# Altium schematic sheet BMS.SchDoc
size A1; SheetNumber: 5; SheetTotal: 6
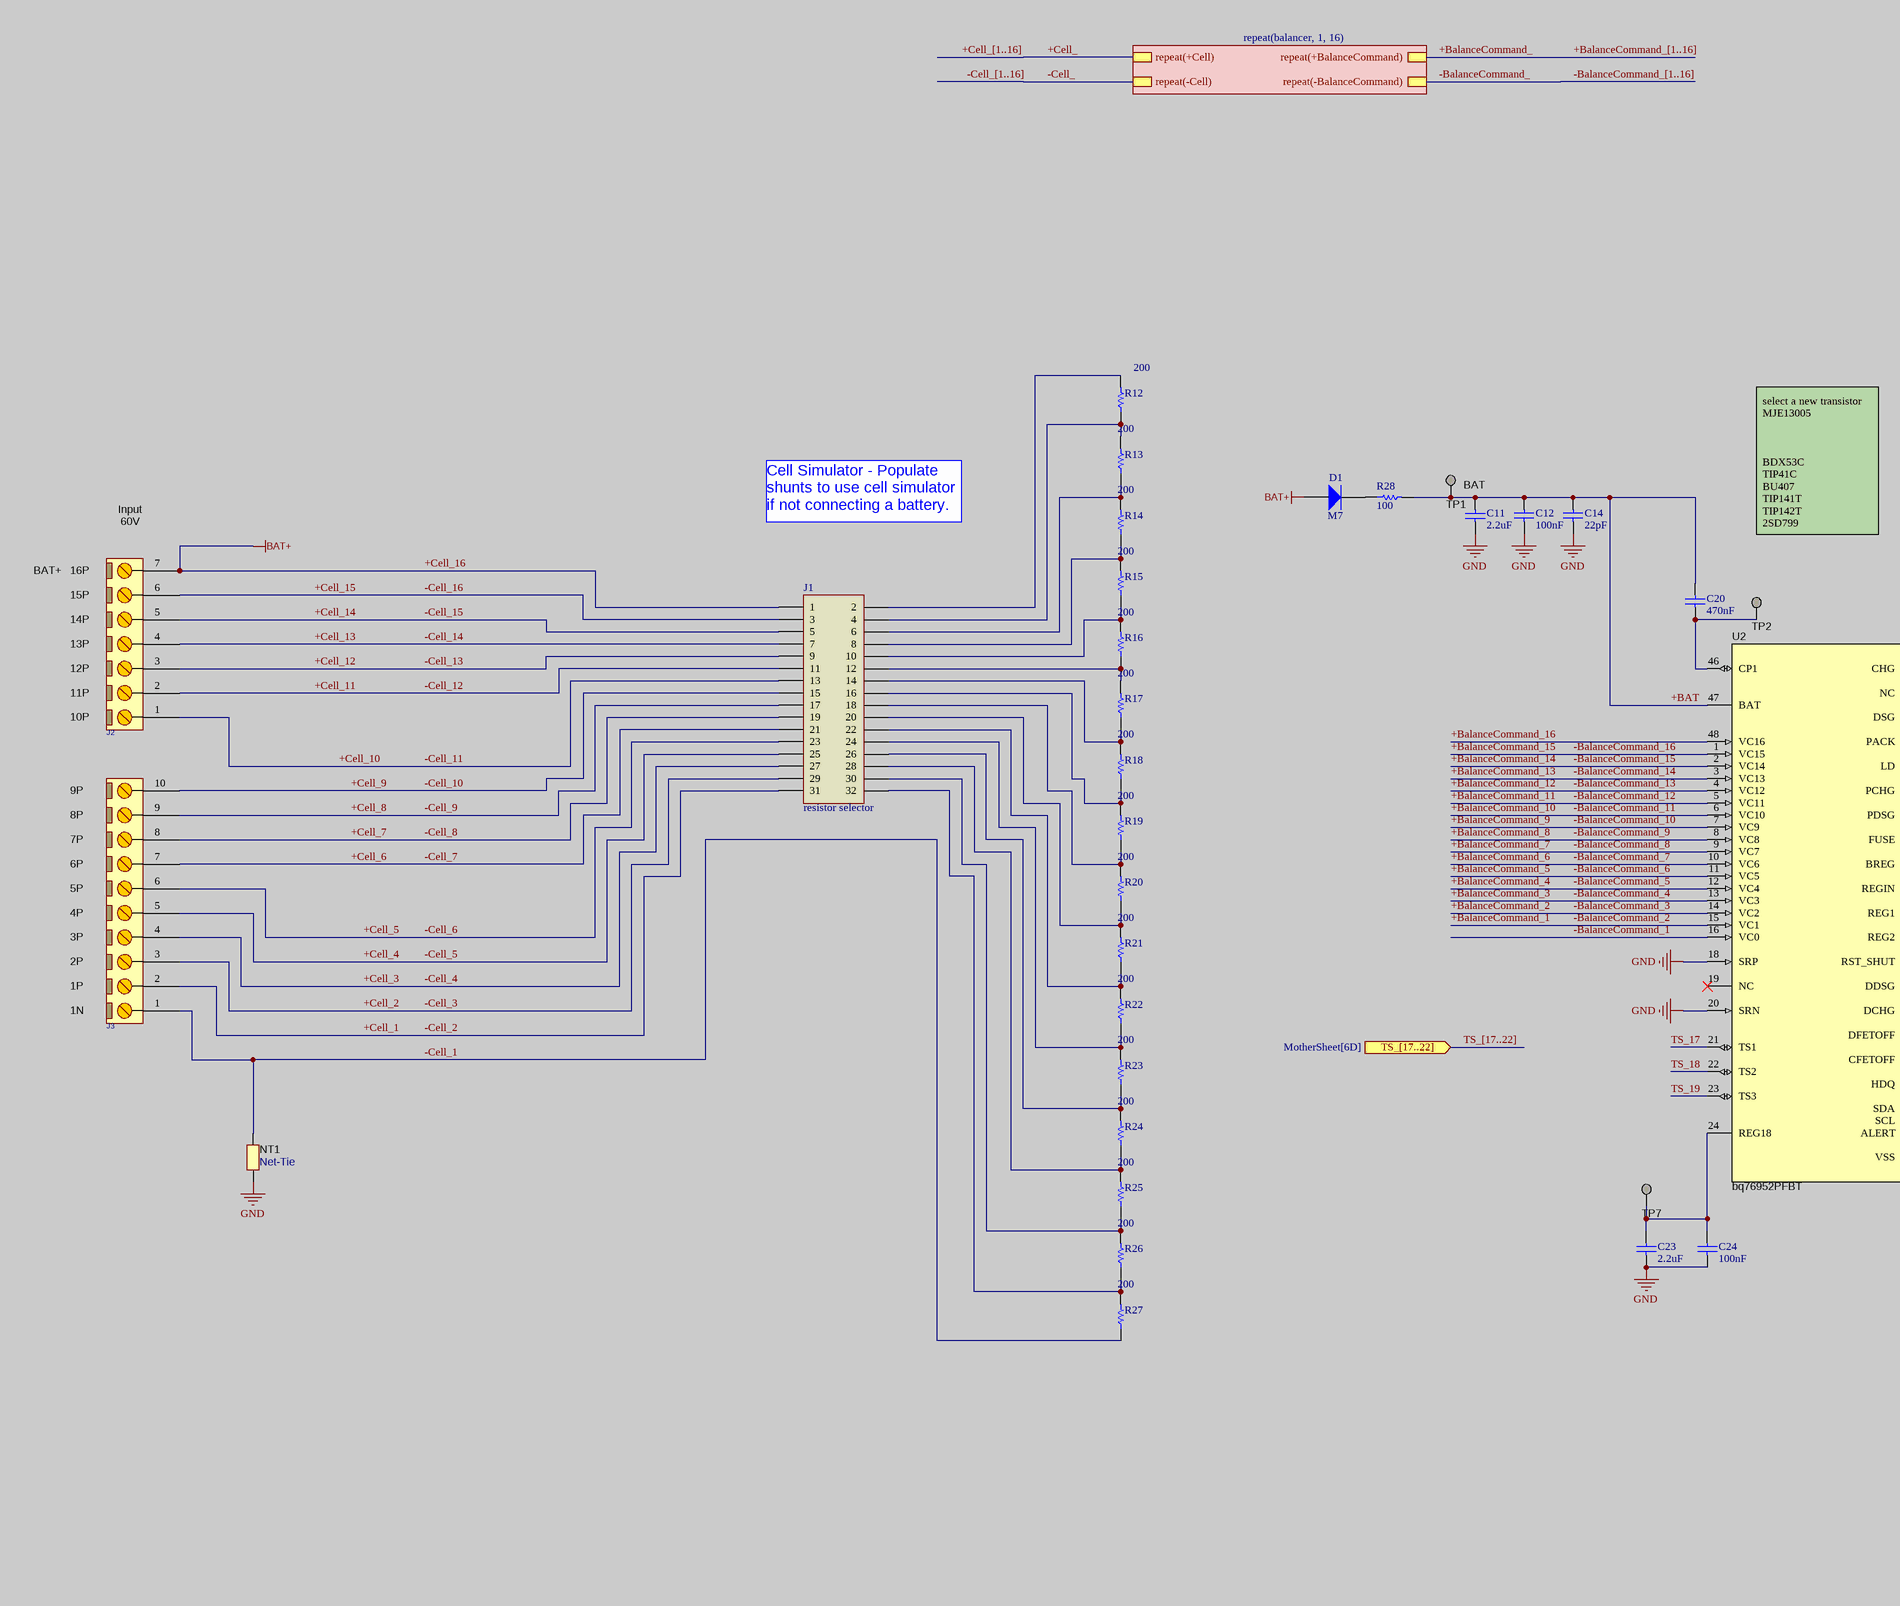
[diagram p0: BMS.SchDoc, left]
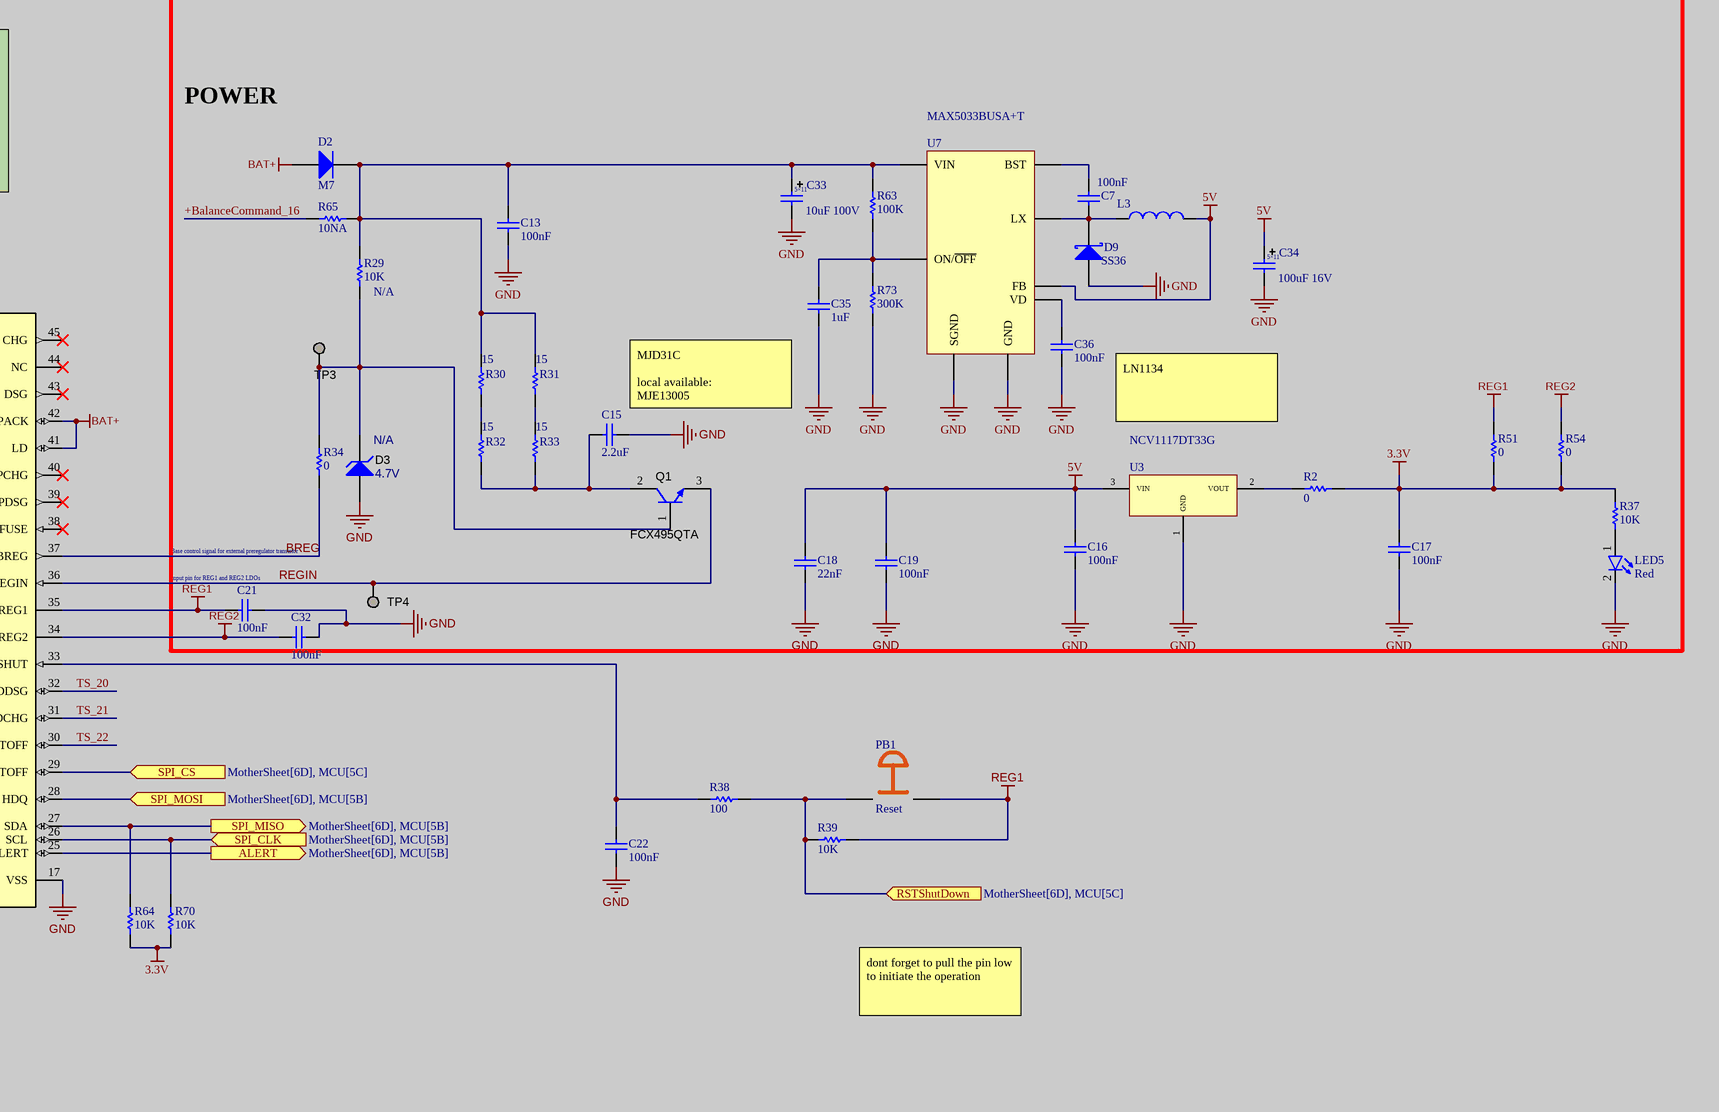
[diagram p1: BMS.SchDoc, right]

## Parts
C7  100nF  [CAPC0603]
C11  2.2uF  [cap1206]
C12  100nF  [CAPC0603]
C13  100nF  [CAPC0603]
C14  22pF  [CAPC0603]
C15  2.2uF  [cap1206]
C16  100nF  [CAPC0603]
C17  100nF  [CAPC0603]
C18  22nF  [CAPC0603]
C19  100nF  [CAPC0603]
C20  470nF  [cap1206]
C21  100nF  [CAPC0603]
C22  100nF  [CAPC0603]
C23  2.2uF  [cap1206]
C24  100nF  [CAPC0603]
C32  100nF  [CAPC0603]
C33  10uF 100V  [CAP 5*11]
C34  100uF 16V  [CAP 5*11]
C35  1uF  [CAPC0603]
C36  100nF  [CAPC0603]
D1  M7  [SS36]
D2  M7  [SS36]
D3  N/A  value 4.7V  [ZENER]
D9  SS36  [SS36]
J1  resistor selector  [SULLINS_PEC10DAAN]
J2  CONN_TB8  [pheonix_7]  (value not drawn)
J3  CONN_TB8  [pheonix_10]  (value not drawn)
L3  22uH  [INDUCTOR 7*7]  (value not drawn)
LED5  Red  [led]
NT1  Net-Tie  [Net-Tie_10milWide_30milLong]  (net tie, no BOM)
PB1  Reset  [SWITCH-PB4]
Q1  FCX495QTA  [sot-89]
R2  0  [RES0603]
R12  200  [RESC0603]
R13  200  [RESC0603]
R14  200  [RESC0603]
R15  200  [RESC0603]
R16  200  [RESC0603]
R17  200  [RESC0603]
R18  200  [RESC0603]
R19  200  [RESC0603]
R20  200  [RESC0603]
R21  200  [RESC0603]
R22  200  [RESC0603]
R23  200  [RESC0603]
R24  200  [RESC0603]
R25  200  [RESC0603]
R26  200  [RESC0603]
R27  200  [RESC0603]
R28  100  [RESC0603]
R29  N/A  value 10K  [RES0603]
R30  15  [RES2512]
R31  15  [RES2512]
R32  15  [RES2512]
R33  15  [RES2512]
R34  0  [RES0603]
R37  10K  [RES0603]
R38  100  [RES0603]
R39  10K  [RES0603]
R51  0  [RES0603]
R54  0  [RES0603]
R63  100K  [RESC0603]
R64  10K  [RES0603]
R65  10NA  [RES0603]
R70  10K  [RES0603]
R73  300K  [RESC0603]
TP1  TESTPOINT  [Test Point]  (value not drawn)  (no BOM)
TP2  TESTPOINT  [Test Point]  (value not drawn)  (no BOM)
TP3  TESTPOINT  [Test Point]  (value not drawn)  (no BOM)
TP4  TESTPOINT  [Test Point]  (value not drawn)  (no BOM)
TP7  TESTPOINT  [Test Point]  (value not drawn)  (no BOM)
U2  bq76952PFBT  [STM32F103C8T6]
U3  NCV1117DT33G  [AMS1117]
U7  MAX5033BUSA+T  [SOIC8]

## Blocks framed on the sheet
POWER: C7 C13 C15-C19 C21 C32-C36 D2 D3 D9 L3 LED5 Q1 R2 R29-R34 R37 R51 R54 R63 R65 R73 TP3 TP4 U3 U7

## Sub-sheets
repeat(balancer, 1, 16) = balancer.SchDoc: repeat(+Cell), repeat(+BalanceCommand), repeat(-Cell), repeat(-BalanceCommand)

## Ports
ALERT (out, see MotherSheet[6D], MCU[5B]), RSTShutDown (in, see MotherSheet[6D], MCU[5C]), SPI_CLK (in, see MotherSheet[6D], MCU[5B]), SPI_CS (in, see MotherSheet[6D], MCU[5C]), SPI_MISO (out, see MotherSheet[6D], MCU[5B]), SPI_MOSI (in, see MotherSheet[6D], MCU[5B]), TS_[17..22] (in, see MotherSheet[6D])

## Nets
3.3V: C17.2 R2.2 R37.1 R51.1 R54.1 R64.2 R70.2
5V: C16.2 C18.2 C19.2 C34.2 L3.2 U3.3(VIN) U7.4(FB)
+Cell_16: D1.1(A) D2.1(A) J1.1 J2.7 U2.41(LD) U2.42(PACK)  [also labelled BAT+]
GND: C11.2 C12.1 C13.1 C14.1 C15.1 C16.1 C17.1 C18.1 C19.1 C21.2 C22.1 C23.1 C24.1 C32.2 C33.1 C34.1 C35.1 C36.1 D3.2(A) D9.1(A) LED5.2(K) NT1.2 R73.1 U2.17(VSS) U2.18(SRP) U2.20(SRN) U3.1(GND) U7.3(SGND) U7.6(GND)
REG1: C21.1 PB1.2 R39.2 R51.2 U2.35(REG1)
REG2: C32.1 R54.2 U2.34(REG2)
+BalanceCommand_: sheet repeat(balancer, 1, 16)/repeat(+BalanceCommand)
+BalanceCommand_1: U2.15(VC1)  [also labelled -BalanceCommand_2]
+BalanceCommand_2: U2.14(VC2)  [also labelled -BalanceCommand_3]
+BalanceCommand_3: U2.13(VC3)  [also labelled -BalanceCommand_4]
+BalanceCommand_4: U2.12(VC4)  [also labelled -BalanceCommand_5]
+BalanceCommand_5: U2.11(VC5)  [also labelled -BalanceCommand_6]
+BalanceCommand_6: U2.10(VC6)  [also labelled -BalanceCommand_7]
+BalanceCommand_7: U2.9(VC7)  [also labelled -BalanceCommand_8]
+BalanceCommand_8: U2.8(VC8)  [also labelled -BalanceCommand_9]
+BalanceCommand_9: U2.7(VC9)  [also labelled -BalanceCommand_10]
+BalanceCommand_10: U2.6(VC10)  [also labelled -BalanceCommand_11]
+BalanceCommand_11: U2.5(VC11)  [also labelled -BalanceCommand_12]
+BalanceCommand_12: U2.4(VC12)  [also labelled -BalanceCommand_13]
+BalanceCommand_13: U2.3(VC13)  [also labelled -BalanceCommand_14]
+BalanceCommand_14: U2.2(VC14)  [also labelled -BalanceCommand_15]
+BalanceCommand_15: U2.1(VC15)  [also labelled -BalanceCommand_16]
+BalanceCommand_16: R65.1 U2.48(VC16)
+BAT: C11.1 C12.2 C14.2 C20.1 R28.2 TP1.1 U2.47(BAT)
+Cell_: sheet repeat(balancer, 1, 16)/repeat(+Cell)
+Cell_1: J1.31 J3.2  [also labelled -Cell_2]
+Cell_2: J1.29 J3.3  [also labelled -Cell_3]
+Cell_3: J1.27 J3.4  [also labelled -Cell_4]
+Cell_4: J1.25 J3.5  [also labelled -Cell_5]
+Cell_5: J1.23 J3.6  [also labelled -Cell_6]
+Cell_6: J1.21 J3.7  [also labelled -Cell_7]
+Cell_7: J1.19 J3.8  [also labelled -Cell_8]
+Cell_8: J1.17 J3.9  [also labelled -Cell_9]
+Cell_9: J1.15 J3.10  [also labelled -Cell_10]
+Cell_10: J1.13 J2.1  [also labelled -Cell_11]
+Cell_11: J1.11 J2.2  [also labelled -Cell_12]
+Cell_12: J1.9 J2.3  [also labelled -Cell_13]
+Cell_13: J1.7 J2.4  [also labelled -Cell_14]
+Cell_14: J1.5 J2.5  [also labelled -Cell_15]
+Cell_15: J1.3 J2.6  [also labelled -Cell_16]
-BalanceCommand_: sheet repeat(balancer, 1, 16)/repeat(-BalanceCommand)
-BalanceCommand_1: U2.16(VC0)
-Cell_: sheet repeat(balancer, 1, 16)/repeat(-Cell)
-Cell_1: J3.1 NT1.1 R27.1
ALERT: U2.25(ALERT) ; port ALERT
BREG: R34.2 U2.37(BREG)
REGIN: Q1.3(E) TP4.1 U2.36(REGIN)
RSTShutDown: PB1.1 R38.2 R39.1 ; port RSTShutDown
SPI_CLK: R70.1 U2.26(SCL) ; port SPI_CLK
SPI_CS: U2.29(CFETOFF) ; port SPI_CS
SPI_MISO: R64.1 U2.27(SDA) ; port SPI_MISO
SPI_MOSI: U2.28(HDQ) ; port SPI_MOSI
TS_17: U2.21(TS1)
TS_18: U2.22(TS2)
TS_19: U2.23(TS3)
TS_20: U2.32(DDSG)
TS_21: U2.31(DCHG)
TS_22: U2.30(DFETOFF)
NetC7_1: C7.1 D9.2(K) L3.1 U7.8(LX)
NetC7_2: C7.2 U7.1(BST)
NetC13_2: C13.2 C33.2 D2.2(K) R29.1 R30.2 R31.2 R63.2 R65.2 U7.7(VIN)
NetC15_2: C15.2 Q1.2(C) R32.1 R33.1
NetC20_2: C20.2 TP2.1 U2.46(CP1)
NetC22_2: C22.2 R38.1 U2.33(RST_SHUT)
NetC23_2: C23.2 C24.2 TP7.1 U2.24(REG18)
NetC35_2: C35.2 R63.1 R73.2 U7.5(ON/~{OFF})
NetC36_2: C36.2 U7.2(VD)
NetD1_2: D1.2(K) R28.1
NetD3_1: D3.1(K) Q1.1(B) R29.2 R34.1 TP3.1
NetJ1_2: J1.2 R12.2
NetJ1_4: J1.4 R12.1 R13.2
NetJ1_6: J1.6 R13.1 R14.2
NetJ1_8: J1.8 R14.1 R15.2
NetJ1_10: J1.10 R15.1 R16.2
NetJ1_12: J1.12 R16.1 R17.2
NetJ1_14: J1.14 R17.1 R18.2
NetJ1_16: J1.16 R18.1 R19.2
NetJ1_18: J1.18 R19.1 R20.2
NetJ1_20: J1.20 R20.1 R21.2
NetJ1_22: J1.22 R21.1 R22.2
NetJ1_24: J1.24 R22.1 R23.2
NetJ1_26: J1.26 R23.1 R24.2
NetJ1_28: J1.28 R24.1 R25.2
NetJ1_30: J1.30 R25.1 R26.2
NetJ1_32: J1.32 R26.1 R27.2
NetLED5_1: LED5.1(A) R37.2
NetR2_1: R2.1 U3.2(VOUT)
NetR30_1: R30.1 R32.2
NetR31_1: R31.1 R33.2

Not connected (* = marked no-connect by the designer): U2 19(NC)* 38(FUSE)* 39(PDSG)* 40(PCHG)* 43(DSG)* 44(NC)* 45(CHG)*

## Buses and harness runs
bus +BalanceCommand_[1..16]
bus +Cell_[1..16]
bus -BalanceCommand_[1..16]
bus -Cell_[1..16]
bus TS_[17..22] = port TS_[17..22]

## Notes on the sheet
- Input
- (near J2) 60V
- Cell Simulator - Populate shunts to use cell simulator if not connecting a battery.
- BAT
- BAT+
- 16P
- select a new transistor
  MJE13005
  BDX53C
  TIP41C
  BU407
  TIP141T
  TIP142T
  2SD799
- 13P
- 15P
- 14P
- 12P
- 11P
- 10P
- MJD31C
  local available:
  MJE13005
- LN1134
- 8P
- 9P
- 6P
- 5P
- 7P
- (near C21) Input pin for REG1 and REG2 LDOs
- Base control signal for external preregulator transistor
- 4P
- 3P
- 2P
- 1P
- 1N
- dont forget to pull the pin low to initiate the operation
- (in symbol CAP 5*11) 5×11

## Library data of the parts
C7 C36 = Capacitor: 100nF-0603; Published: 8-Jun-2000; LatestRevisionDate: 17-Jul-2002; LatestRevisionNote: Re-released for DXP Platform.; PackageReference: C0805; Publisher: Altium Limited; Value: 100nF
C11-C24 C32 = Capacitor: Published: 8-Jun-2000; LatestRevisionDate: 17-Jul-2002; LatestRevisionNote: Re-released for DXP Platform.; PackageReference: C0805; Publisher: Altium Limited
  C11 C15 C23: Value: 2.2uF
  C12 C13 C16 C17 C19 C21 C22 C24 C32: Value: 100nF
  C14: Value: 22pF
  C18: Value: 22nF
  C20: Value: 470nF
C33 C34 = CAP 5*11
C35 = Capacitor: 1uF-0603; Published: 8-Jun-2000; LatestRevisionDate: 17-Jul-2002; LatestRevisionNote: Re-released for DXP Platform.; PackageReference: C0805; Publisher: Altium Limited; Value: 1uF
D1 D2 = SS36
D3 = CMP-0005740-3: Diode, Zener, 4.7 V, 500 mW; Manufacturer: ON Semiconductor; PartNumber: MMSZ4697T1G; SizeY_mm: 1.7; SizeX_mm: 3.85; RJA_CperW: 340; SizeAreaWB_mm2: 13.095; AEC Category: Q101; Power_W: 500mW; SizeZ_mm: 1.35; Vz_V: 10V; Value1: 0.5W; SizeArea_mm2: 6.545; PackageReference: SOD-123; AEC Qualified: ?; MountType: SMT; RoHS: Y; ComponentLink1Description: Datasheet link; CompType: Zener; ComponentLink1URL: http://www.onsemi.com/pub_link/Collateral/MMSZ4678T1-D.PDF
D9 = SS34: SS36 -Jled; Published: 8-Jun-2000; LatestRevisionDate: 17-Jul-2002; LatestRevisionNote: Re-released for DXP Platform.; PackageReference: SMB; Publisher: Altium Limited; Code_JEDEC: DO-214-AA
J1 = Header 2*16 LED: Header 2*16 LED 2mm
J2 = CONN_TB7: CONN, TERMINAL BLOCK, 5.08mm pitch; VALUE: CONN_TB8
J3 = CONN_TB10: CONN, TERMINAL BLOCK, 5.08mm pitch; VALUE: CONN_TB8
L3 = INDUCTOR 7*7
LED5 = LED: Designer: Saeid Jorablo; Organazation: ControTec; Adding Date: 1387/12/22; Color: Red; Size: SMD 0603
NT1 = Net-Tie: Single point connection between nets.; MountType: SMT; PackageReference: N/A; CompType: Net-Tie; Manufacturer: N/A; PartNumber: N/A
PB1 = Swtich-PB4: 4-Pin Push Button
Q1 = BSR14, Nexperia: BJT 30V 3A 40V 10W SI-NPN; PartNumber: BSR14; U/M: EA; Value1: 0.8 A; Value2: 300; SizeAreaWB_mm2: 14; SizeArea_mm2: 7.5; SizeX_mm: 2.5; SizeY_mm: 3; SizeZ_mm: 1.1; AEC Category: Q101; PNP: 0; NPN: 1; Vceo_V: 40; Vcesat1_V: 0.3; IcRated_A: 0.8; TaMin_C: -65; TaMax_C: 150; SymbolVersion: 2008-07-31; CompType: BJT; Manufacturer: Nexperia; PackageReference: SOT-23; Value: 40 V; RoHS: Y; MountType: SMT; Published: 2008-07-31; Publisher: Texas Instruments; LatestRevisionDate: 2017-06-09; ComponentLink1Description: Datasheet link; ComponentLink1URL: http://www.nexperia.com/documents/data_sheet/BSR13_BSR14.pdf; Supplier 1: Digi-Key; Supplier Part Number 1: 568-6225-1-ND; AEC Qualified: ?; HfeMax: 300
R2 R29 R34 R37-R39 R51 R54 R64 R65 R70 = Res: Resistor; Published: 8-Jun-2000; LatestRevisionDate: 17-Jul-2002; LatestRevisionNote: Re-released for DXP Platform.; PackageReference: AXIAL-0.3; Publisher: Altium Limited; PackageDescription: Axial Device, Thru-Hole; 2 Leads; 0.3 in Pin Spacing
  R2 R34 R51 R54: Value: 0
  R37 R39 R64 R70: Value: 10K
  R38: Value: 100
  R65: Value: 10NA
R12-R28 = Resistor: 0603,0.1W; PackageReference: AXIAL-0.5; Published: 8-Jun-2000; LatestRevisionDate: 17-Jul-2002; LatestRevisionNote: Re-released for DXP Platform.; Publisher: Altium Limited
  R12-R27: Value: 200
  R28: Value: 100
R30-R33 = Resistor_2: 0603,0.1W; Value: 15; PackageReference: AXIAL-0.5; Published: 8-Jun-2000; LatestRevisionDate: 17-Jul-2002; LatestRevisionNote: Re-released for DXP Platform.; Publisher: Altium Limited
R63 = Resistor: 100K-0603; Value: 866K; Published: 8-Jun-2000; LatestRevisionDate: 17-Jul-2002; LatestRevisionNote: Re-released for DXP Platform.; PackageReference: AXIAL-0.5; Publisher: Altium Limited
R73 = Resistor: 300K-0603; Value: 2.5M; Published: 8-Jun-2000; LatestRevisionDate: 17-Jul-2002; LatestRevisionNote: Re-released for DXP Platform.; PackageReference: AXIAL-0.5; Publisher: Altium Limited
TP1-TP4 TP7 = TESTPOINT: TEST POINT.  No entry in BOM.; PartNumber: N/A; CompType: Testpoint; Manufacturer: N/A; PackageReference: N/A
U2 = bq76952: Multicell Battery Monitor and Protection Family, PFB0048A (TQFP-48); Alternate PartNumber: bq76952PFBR; Alternate Manufacturer: Texas Instruments; SizeAreaWB_mm2: 121; SizeZ_mm: 1.2; SizeX_mm: 9; SizeArea_mm2: 81; CompType: IC; AEC Qualified: N; AEC Category: Q200; ComponentLink1URL: http://www.ti.com/lit/ds/symlink/bq76952.pdf; PackageDescription: TQFP-48; MountType: SMT; ComponentLink2URL: http://www.ti.com/product/bq76952; ComponentLink3Description: Online Datasheet; ComponentLink2Description: Product Folder; Manufacturer: Texas Instruments; ComponentLink3URL: http://www.ti.com/product/bq76952/datasheet; PackageReference: PFB0048A; SizeY_mm: 9; PartNumber: bq76952PFBT; ComponentLink1Description: Datasheet Link
U3 = AMS1117: High Accuracy, Ultralow IQ, 1.5 A, anyCAP Low Dropout Regulator
U7 = MAX5033: High-Efficiency, MAXPower    Step-Down DC-DC Converter